# EAGLE design Master (EAGLE 9.3.0)
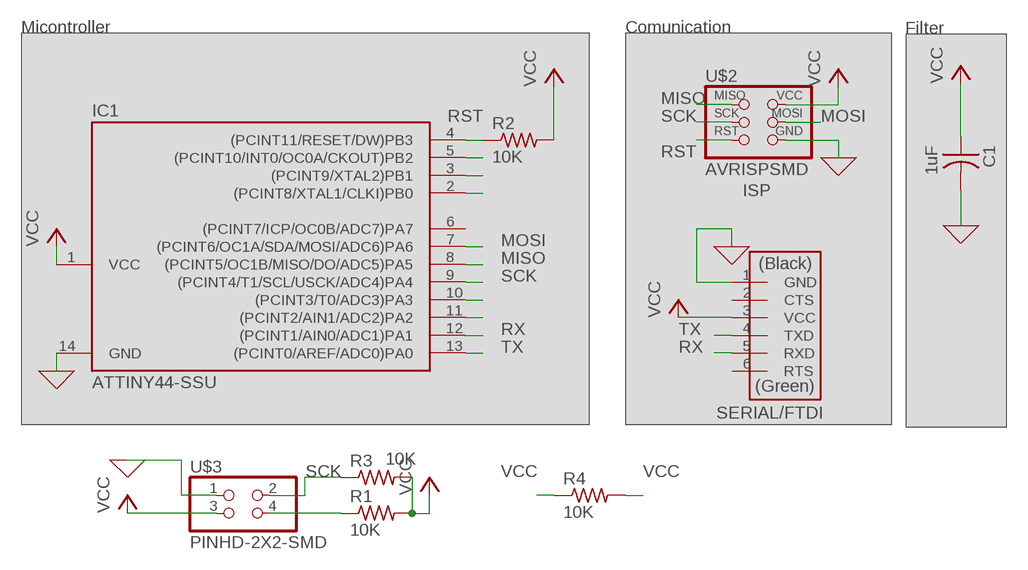
[diagram p0: schematic, sheet 1]

## Parts
C1  1uF  CAP-US1206FAB  [C1206FAB]
IC1  ATTINY44-SSU  [SOIC14]
R1  10K  RES-US1206FAB  [R1206FAB]
R2  10K  RES-US1206FAB  [R1206FAB]
R3  10K  RES-US1206FAB  [R1206FAB]
R4  10K  RES-US1206FAB  [R1206FAB]
U$1  FTDI-SMD-HEADER  [1X06SMD]
U$2  AVRISPSMD  [2X03SMD]
U$3  PINHD-2X2-SMD  [2X02SMD]

## Nets
0: C1.2 IC1.14(GND) U$1.1(GND) U$2.6(GND) U$3.1 ; supply symbol labelled GND
MISO: IC1.8((PCINT5/OC1B/MISO/DO/ADC5)PA5) U$2.1(MISO)
MOSI: IC1.7((PCINT6/OC1A/SDA/MOSI/ADC6)PA6) R1.1 U$2.4(MOSI) U$3.4
N$5: IC1.5((PCINT10/INT0/OC0A/CKOUT)PB2)
N$6: IC1.3((PCINT9/XTAL2)PB1)
N$7: IC1.2((PCINT8/XTAL1/CLKI)PB0)
N$12: IC1.10((PCINT3/T0/ADC3)PA3)
N$13: IC1.11((PCINT2/AIN1/ADC2)PA2)
RST: IC1.4((PCINT11/RESET/DW)PB3) R2.1 U$2.5(RST)
RX: IC1.12((PCINT1/AIN0/ADC1)PA1) U$1.5(RXD)
SCK: IC1.9((PCINT4/T1/SCL/USCK/ADC4)PA4) R3.1 U$2.3(SCK) U$3.2
TX: IC1.13((PCINT0/AREF/ADC0)PA0) U$1.4(TXD)
VCC: C1.1 IC1.1(VCC) R1.2 R2.2 R3.2 R4.1 R4.2 U$1.3(VCC) U$2.2(VCC) U$3.3
Unconnected: IC1.6((PCINT7/ICP/OC0B/ADC7)PA7) U$1.2(CTS) U$1.6(RTS)

## Notes on the sheet
- Micontroller | Comunication | Filter
- ISP
- SERIAL/FTDI

## Library data of the parts
C1 = fab:CAP-US
IC1 = fab:ATTINY44
R1-R4 = fab:RES-US: Resistor (US Symbol) Variants with postfix FAB are widened to allow the routing of internal traces
U$1 = fab:FTDI-SMD-HEADER
U$2 = fab:AVRISP
U$3 = fab:PINHD-2X2-SMD

## Board
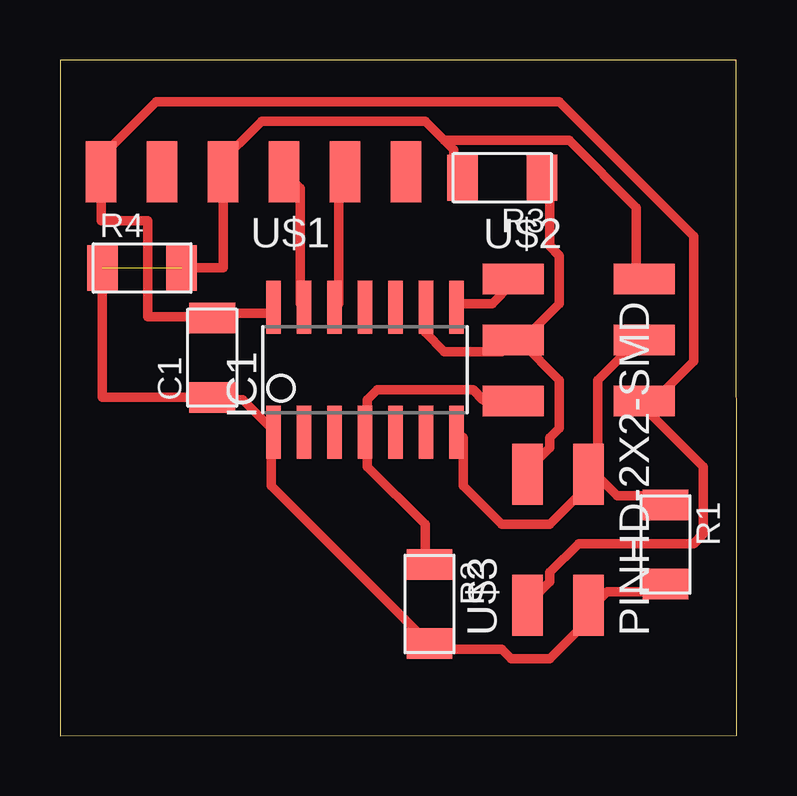
[diagram p1: board, top side]

Size 28.19 x 28.15 mm. Coordinates in mm from the lower left corner, seen from the top.
Outline: 0.01,0 28.19,0.01 28.18,28.15 0,28.13 0.01,0
Copper layers (1*16): Top 0.035mm / dielectric 1.5mm / Bottom 0.035mm
Design rules "default *": minimum track width 0.4mm, minimum drill 0.35mm, track to track 0.4mm, track to pad 0.4mm, pad to pad 0.4mm, via to via 0.4mm, smd to smd 0.4mm, copper to edge 40mil, drill to drill 6mil, minimum pad ring 10mil, minimum via ring 8mil, stop-mask expansion 4mil, vias tented up to drill 0mil, thermal gap 10mil

### Footprints (pad centres in the part's own frame; a part is rotated, then mirrored left to right if it is on the bottom)
C1206FAB = smd 1.27 x 1.905: 1 -1.651,0; 2 1.651,0
SOIC14 = smd 0.61 x 2.21: 1 -3.81,-2.603; 2 -2.54,-2.603; 3 -1.27,-2.603; 4 0,-2.603; 5 1.27,-2.603; 6 2.54,-2.603; 7 3.81,-2.603; 8 3.81,2.603; 9 2.54,2.603; 10 1.27,2.603; 11 0,2.603; 12 -1.27,2.603; 13 -2.54,2.603; 14 -3.81,2.603
R1206FAB = smd 1.27 x 1.905: 1 -1.651,0; 2 1.651,0
1X06SMD = smd 2.54 x 1.27: 1 0,6.35; 2 0,3.81; 3 0,1.27; 4 0,-1.27; 5 0,-3.81; 6 0,-6.35
2X03SMD = smd 2.54 x 1.27: 1 -2.54,2.54; 2 2.92,2.54; 3 -2.54,0; 4 2.92,0; 5 -2.54,-2.54; 6 2.92,-2.54
2X02SMD = smd 2.54 x 1.27: 1 -2.54,1.27; 2 2.92,1.27; 3 -2.54,-1.27; 4 2.92,-1.27

### Placement (x,y rotation side)
C1  6.34,15.74 90 top
IC1  12.71,15.24 0 top
R1  25.22,7.96 270 top
R2  15.39,5.48 270 top
R3  18.43,23.24 180 top
R4  3.42,19.48 0 top
U$1  8.07,23.5 90 top
U$2  21.43,16.48 0 top
U$3  20.75,7.96 90 top

### Tracks (layer width: path | path; a pad name or v marks a point on that pad's centre or on a via)
0
  Top 0.4: C1.2 6.41,17.6 8.81,17.6 IC1.14 | 2.01,23.34 U$1.1 | 6.01,17.6 C1.2 | 24.41,13.6 26.81,11.2 26.81,8.4 26.41,8 21.61,8 20.41,6.8 20.41,6.4 19.61,5.6 U$3.1 | 24.41,13.6 26.41,15.6 26.41,20.8 20.81,26.4 4.01,26.4 2.01,24.4 2.01,23.64 U$1.1 | 24.41,13.6 U$2.6 | U$1.1 1.72,21.44 3.65,21.44 3.65,17.45 6.34,17.45 C1.2
MISO
  Top 0.4: IC1.8 16.81,18 18.01,18 18.81,18.8 U$2.1
MOSI
  Top 0.4: 22.41,10.8 23.21,10 25.21,10 R1.1 | 22.41,10.8 20.41,8.8 18.41,8.8 16.81,10.4 16.81,12.4 IC1.7 | 22.41,10.8 U$3.4 22.41,11.2 22.41,14.8 24.01,16.4 U$2.4
RST
  Top 0.4: R2.1 15.21,7.2 15.21,8.8 12.81,11.2 12.81,12.4 IC1.4 12.81,12.8 12.81,14 13.21,14.4 17.21,14.4 17.61,14 18.81,14 U$2.5
RX
  Top 0.4: IC1.12 11.61,18 11.61,23.18 U$1.5
SCK
  Top 0.4: 19.21,16.4 20.81,18 20.81,20 20.41,20.4 20.41,23.2 R3.1 | IC1.9 15.21,17.6 15.21,16.8 16.01,16 18.41,16 18.81,16.4 U$2.3 19.21,16.4 | 19.21,16.4 20.81,14.8 20.81,12.8 20.41,12.4 20.41,12 19.61,11.2 U$3.2
TX
  Top 0.4: IC1.13 10.01,18 10.01,22.8 9.37,23.44 U$1.4
VCC  (1 unrouted)
  Top 0.4: R1.2 25.21,6 22.81,6 22.41,5.6 U$3.3 22.41,5.2 20.41,3.2 18.81,3.2 18.41,3.6 15.61,3.6 R2.2 15.21,4 8.81,10.4 8.81,12.4 IC1.1 8.81,12.8 7.61,14 6.41,14 C1.1 1.77,14.09 R4.1 | 16.01,24.8 15.21,25.6 8.41,25.6 6.5,23.69 U$1.3 6.8,19.48 R4.2 | 16.01,24.8 16.41,24.4 16.41,23.6 R3.2 | 16.01,24.8 21.21,24.8 24.01,22 24.01,19.2 U$2.2